# EAGLE design Clock Module (EAGLE 6.4)
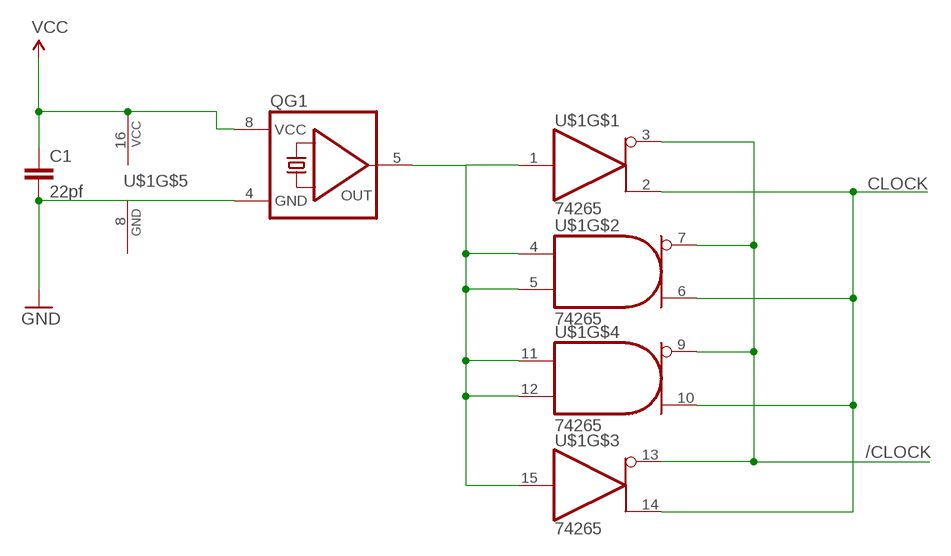
[diagram p0: schematic, sheet 1]

## Parts
C1  22pf  CAPEZ  [CAP-PTH-SMALLEZ]
QG1  QG5460  [DIL08S]
U$1  74265  [DIL16]

## Nets
/CLOCK: U$1.3(Y) U$1.7(Y) U$1.9(Y) U$1.13(Y)
CLOCK: U$1.2(W) U$1.6(W) U$1.10(W) U$1.14(W)
GND: C1.2 QG1.4(GND)
N$4: QG1.5(OUT) U$1.1(I) U$1.4(A) U$1.5(B) U$1.11(A) U$1.12(B) U$1.15(I)
VCC: C1.1 QG1.8(VCC) U$1.16(VCC)

## Power pins joined to a net without a drawn wire
GND: U$1.8(GND)

## Library data of the parts
C1 = SparkFun-Passives:CAP: Capacitor Standard 0603 ceramic capacitor, and 0.1" leaded capacitor.
QG1 = crystal:QG5460: CRYSTAL RESONATOR; OC_FARNELL: unknown; OC_NEWARK: unknown
U$1 = 74xx-us:74*265: 74265 Quad Complementary Output Elements

## Board
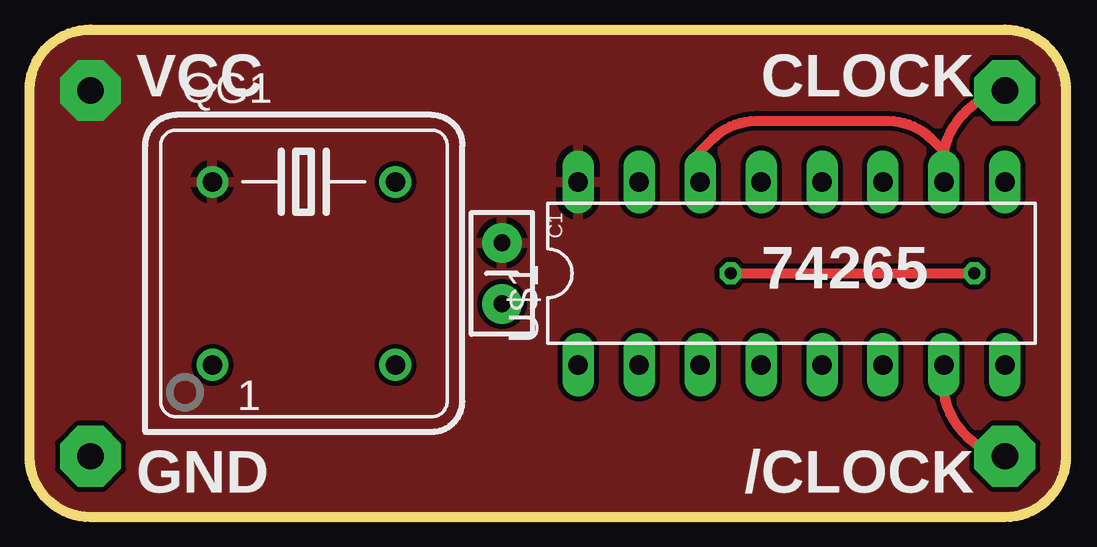
[diagram p1: board, top side]
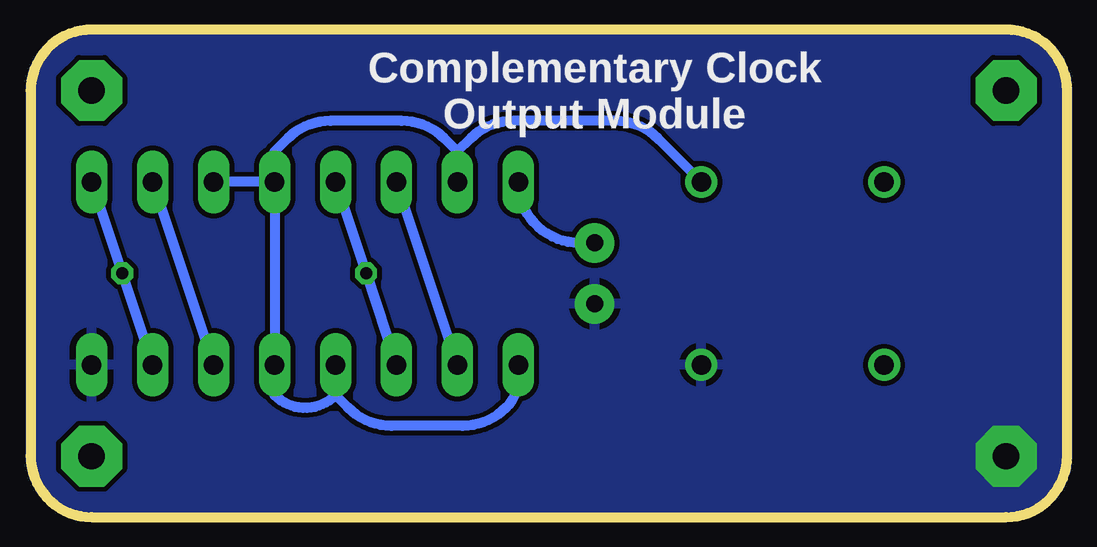
[diagram p2: board, bottom side, seen from below]

No outline drawn. Coordinates in mm, seen from the top.
Copper layers (1*16): Top 0.035mm / dielectric 1.5mm / Bottom 0.035mm
Design rules "default": minimum track width 10mil, minimum drill 24mil, track to track 8mil, track to pad 8mil, pad to pad 8mil, via to via 8mil, smd to smd 8mil, copper to edge 40mil, drill to drill 8mil, minimum pad ring 10mil, minimum via ring 8mil, stop-mask expansion 4mil, vias tented up to drill 0mil, thermal gap 10mil
Milling: 8 lines

### Footprints (pad centres in the part's own frame; a part is rotated, then mirrored left to right if it is on the bottom)
CAP-PTH-SMALLEZ = drill 0.7 pad 1.651: 1 0,0; 2 2.54,0
DIL08S = drill 0.813: 1 -3.81,-3.81; 4 3.81,-3.81; 5 3.81,3.81; 8 -3.81,3.81
DIL16 = drill 0.813 long: 1 -8.89,-3.81; 2 -6.35,-3.81; 3 -3.81,-3.81; 4 -1.27,-3.81; 5 1.27,-3.81; 6 3.81,-3.81; 7 6.35,-3.81; 8 8.89,-3.81; 9 8.89,3.81; 10 6.35,3.81; 11 3.81,3.81; 12 1.27,3.81; 13 -1.27,3.81; 14 -3.81,3.81; 15 -6.35,3.81; 16 -8.89,3.81

### Placement (x,y rotation side)
C1  20.95,12.7 270 top
QG1  12.7,11.43 0 top
U$1  33.02,11.43 0 top

### Tracks (layer width: path | path; a pad name or v marks a point on that pad's centre or on a via)
/CLOCK  (via drill 0.5, 1.1 pad 2.54)
  Top 0.406: U$1.7 arc90 v41.91,3.81 | v30.48,11.43 v40.64,11.43
  Bottom 0.406: U$1.3 v30.48,11.43 U$1.13 | U$1.9 v40.64,11.43 U$1.7
CLOCK  (via drill 1.1 pad 2.54)
  Top 0.406: v41.91,19.05 arc90 U$1.10 39.37,16.51 38.84,17.04 arc45 37.05,17.78 31.53,17.78 arc45 29.74,17.04 29.21,16.51 U$1.14
  Bottom 0.406: U$1.14 U$1.2 | U$1.10 U$1.6
GND  (via drill 1.1 pad 2.54)
  other vias: 3.81,3.81
  pour Bottom: 3.81,21.59 arc90 1.27,19.05 1.27,3.81 arc90 3.81,1.27 41.91,1.27 arc90 44.45,3.81 44.45,19.05 arc90 41.91,21.59
N$4
  Bottom 0.406: U$1.12 U$1.11 | U$1.12 U$1.5 34.29,6.35 arc-90 31.75,6.35 | QG1.5 18.31,17.04 arc-45 20.1,17.78 24.35,17.78 arc-45 26.14,17.04 26.67,16.51 | U$1.15 26.67,16.51 | 26.67,16.51 27.2,17.04 arc-45 28.99,17.78 31.97,17.78 arc-45 33.76,17.04 34.29,16.51 U$1.12 | U$1.1 24.13,7.09 arc45 24.66,5.82 arc45 26.45,5.08 29.43,5.08 arc45 31.22,5.82 31.75,6.35 | U$1.4 31.75,6.35
VCC  (via drill 1.1 pad 2.54)
  Bottom 0.406: C1.1 21.59,12.7 arc90 U$1.16
  other vias: 3.81,19.05
  pour Top: 3.81,21.59 arc90 1.27,19.05 1.27,3.81 arc90 3.81,1.27 41.91,1.27 arc90 44.45,3.81 44.45,19.05 arc90 41.91,21.59

### Text on the board
tPlace: VCC | CLOCK | 74265 | GND | /CLOCK
bPlace: Complementary Clock / Output Module